# EAGLE design Front PCB (EAGLE 5.11)
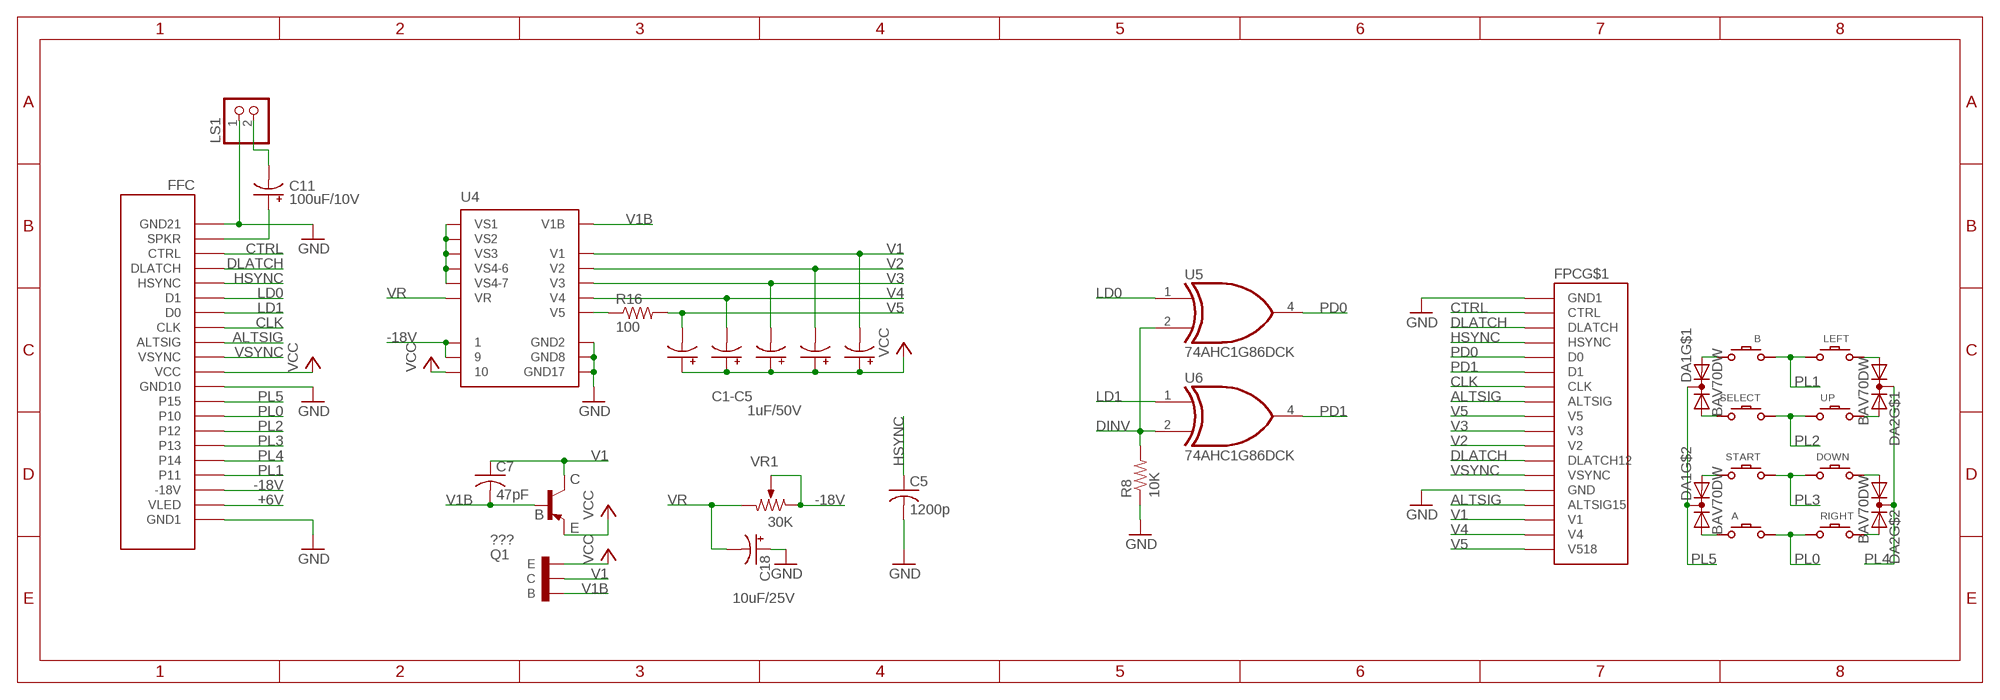
[diagram p0: schematic, sheet 1]

## Parts
A  DMG-BTN  DMG-BTNREGULAR  [DMG-BTN]
B  DMG-BTN  DMG-BTNREGULAR  [DMG-BTN]
C5  1200p  C0603  [R0603]
C7  47pF  C0603  [R0603]
C11  100uF/10V  C1206  [C1206]
C13  1uF/50V  C1206  [C1206]
C14  1uF/50V  C1206  [C1206]
C15  1uF/50V  C1206  [C1206]
C16  1uF/50V  C1206  [C1206]
C17  1uF/50V  C1206  [C1206]
C18  10uF/25V  C1206  [C1206]
DA1  BAV70DW  [SOT363]
DA2  BAV70DW  [SOT363]
DOWN  DMG-BTN  DMG-BTNREGULAR  [DMG-BTN]
FFC  DMG-SCREENFFC  [DMG-FFC]
FPC  MGB-SCREEN  [MGB-SCREEN]
LEFT  DMG-BTN  DMG-BTNREGULAR  [DMG-BTN]
LS1  PINHD-1X2LONG  [1X02]
Q1  ???  BF821SMD  [SOT23-BEC]
Q2  ECB  [ECB]
R8  10K  R0603  [R0603]
R16  100  R0603  [R0603]
RIGHT  DMG-BTN  DMG-BTNREGULAR  [DMG-BTN]
SELECT  DMG-BTN  DMG-BTNSELECT  [DMG-SEL]
START  DMG-BTN  DMG-BTNSTART  [DMG-ST]
U4  DMG-REG  [DMG-AMP]
U5  74AHC1G86DCK  [SC70-5]
U6  74AHC1G86DCK  [SC70-5]
UP  DMG-BTN  DMG-BTNREGULAR  [DMG-BTN]
VR1  30K  DMG-CONTRAST  [DMG-POT]

## Nets
+6V: FFC.P$2(VLED)
-18V: FFC.P$3(-18V) U4.P$1 U4.P$9 VR1.P$1 VR1.P$2
ALTSIG: FFC.P$13(ALTSIG) FPC.P$8(ALTSIG) FPC.P$15(ALTSIG15)
CLK: FFC.P$14(CLK) FPC.P$7(CLK)
CTRL: FFC.P$19(CTRL) FPC.P$2(CTRL)
DINV: R8.2 U5.2(I1) U6.2(I1)
DLATCH: FFC.P$18(DLATCH) FPC.P$3(DLATCH) FPC.P$12(DLATCH12)
GND: C5.2 C18.+ FFC.P$1(GND1) FFC.P$10(GND10) FFC.P$21(GND21) FPC.P$1(GND1) FPC.P$14(GND) LS1.1 R8.1 U4.P$2(GND2) U4.P$8(GND8) U4.P$17(GND17)
HSYNC: C5.1 FFC.P$17(HSYNC) FPC.P$4(HSYNC)
LD0: FFC.P$16(D1) U5.1(I0)
LD1: FFC.P$15(D0) U6.1(I0)
N$1: DA2.P$5(A2) RIGHT.P$2
N$2: DA2.P$4(A1) DOWN.P$1
N$3: B.P$2 DA1.P$2(A2)
N$4: DA2.P$1(A1) LEFT.P$1
N$5: A.P$1 DA1.P$4(A1)
N$6: DA1.P$1(A1) SELECT.P$2
N$7: DA1.P$5(A2) START.P$2
N$8: DA2.P$2(A2) UP.P$2
N$10: R16.1 U4.P$14(V5)
N$11: U4.P$3(VS1) U4.P$4(VS2) U4.P$5(VS3) U4.P$6(VS4-6) U4.P$7(VS4-7)
N$14: C11.- LS1.2
PD0: FPC.P$5(D0) U5.4(O)
PD1: FPC.P$6(D1) U6.4(O)
PL0: A.P$2 FFC.P$8(P10) RIGHT.P$1
PL1: B.P$1 FFC.P$4(P11) LEFT.P$2
PL2: FFC.P$7(P12) SELECT.P$1 UP.P$1
PL3: DOWN.P$2 FFC.P$6(P13) START.P$1
PL4: DA2.P$3(K) DA2.P$6(K) FFC.P$5(P14)
PL5: DA1.P$3(K) DA1.P$6(K) FFC.P$9(P15)
SPKR: C11.+ FFC.P$20(SPKR)
V1: C7.1 C16.- FPC.P$16(V1) Q1.C Q2.P$2(C) U4.P$12(V1)
V1B: C7.2 Q1.B Q2.P$3(B) U4.P$11(V1B)
V2: C14.- FPC.P$11(V2) U4.P$15(V2)
V3: C13.- FPC.P$10(V3) U4.P$16(V3)
V4: C15.- FPC.P$17(V4) U4.P$13(V4)
V5: C17.- FPC.P$9(V5) FPC.P$18(V518) R16.2
VCC: C13.+ C14.+ C15.+ C16.+ C17.+ FFC.P$11(VCC) Q1.E Q2.P$1(E) U4.P$10
VR: C18.- U4.P$18(VR) VR1.P$5
VSYNC: FFC.P$12(VSYNC) FPC.P$13(VSYNC)

## Notes on the sheet
- C1-C5
- C
- B
- E

## Power pins joined to a net without a drawn wire
GND: FPC.P$19(GND) FPC.P$20(GND) U5.3(GND) U6.3(GND) VR1.P$6(GND) VR1.P$7(GND)
VCC: U5.5(VCC) U6.5(VCC)

## Library data of the parts
A B DOWN LEFT RIGHT SELECT START UP = Game Boy:DMG-BTN
C5 C7 = Misc:C0603
C11 C13-C18 = Misc:C1206
DA1 DA2 = Misc:BAV70DW
FFC = Game Boy:DMG-SCREEN: The white connector for the ribbon cable to connect the DMG's front half
FPC = Game Boy:MGB-SCREEN
LS1 = header:PINHD-1X2: PIN HEADER
Q1 = transistor-pnp:BF821*: PNP Transistror
Q2 = Game Boy:ECB
R8 R16 = Misc:R0603
U4 = Game Boy:DMG-REG
U5 U6 = 74xx-little-us:74*1G86: 2-input EXCLUSIV-OR gate
VR1 = Game Boy:DMG-CONTRAST

## Board
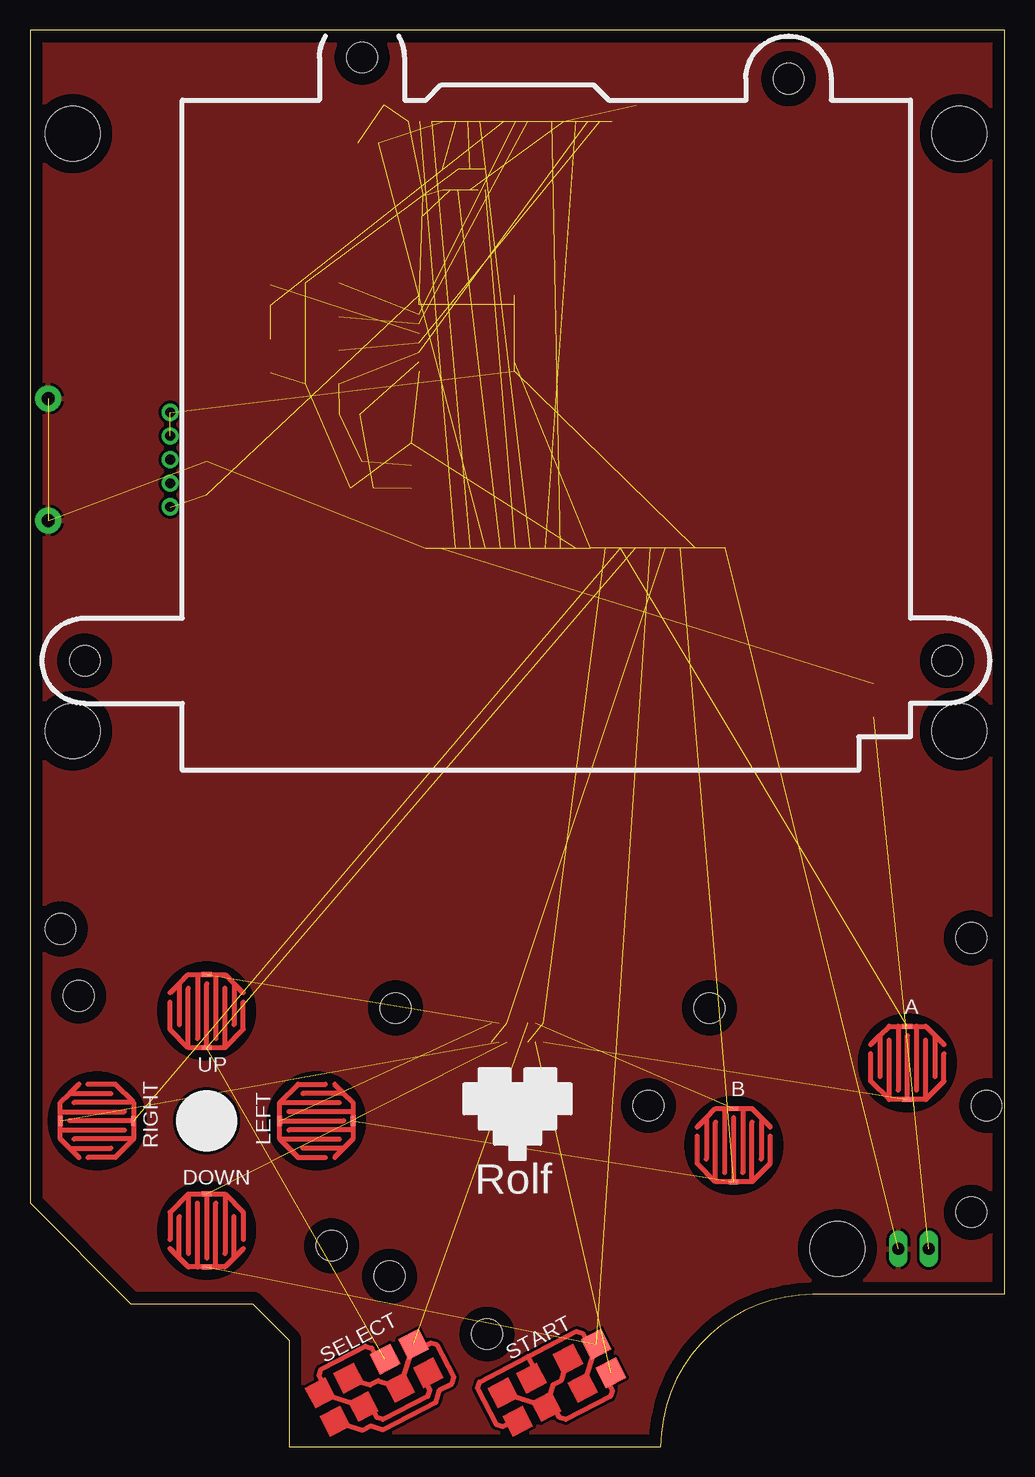
[diagram p1: board, top side]
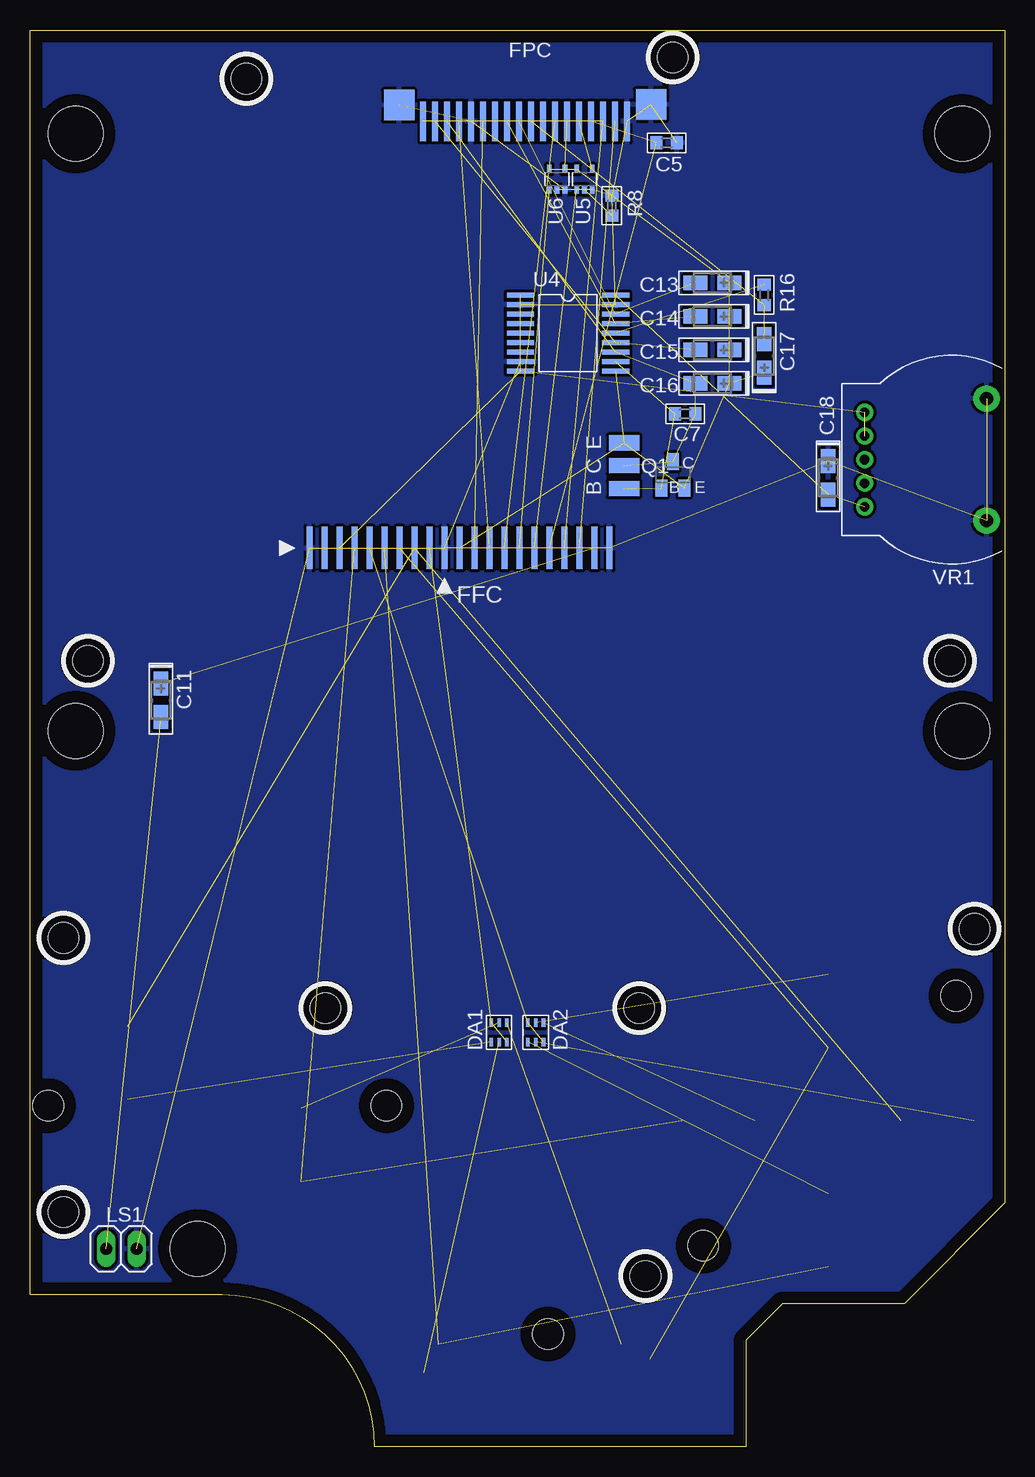
[diagram p2: board, bottom side, seen from below]

Size 81.28 x 118.11 mm. Coordinates in mm from the lower left corner, seen from the top.
Outline: 0,20.32 8.38,11.94 18.54,11.94 21.59,8.89 21.59,0 52.58,0 arc-90 65.28,12.7 81.28,12.7 81.28,118.11 0,118.11 0,20.32
Copper layers (1*16): Top 0.035mm / dielectric 1.5mm / Bottom 0.035mm
Design rules "default *": minimum track width 10mil, minimum drill 20mil, track to track 10mil, track to pad 10mil, pad to pad 10mil, via to via 10mil, smd to smd 10mil, copper to edge 40mil, drill to drill 20mil, minimum pad ring 10mil, minimum via ring 8mil, stop-mask expansion 4mil, vias tented up to drill 20mil, thermal gap 10mil
Holes 4.57 mm at 3.56,59.69 77.47,59.69 3.56,109.47 77.47,109.47 67.31,16.51
Holes 2.54 mm at 27.69,115.82 63.25,114.05 76.45,65.53 2.54,43.18 78.49,42.42 78.49,19.56 30.48,36.58 56.64,36.58 29.97,14.22 51.56,28.45 25.15,16.76 38.1,9.4 79.76,28.45 4.06,37.59 4.57,65.53

### Footprints (pad centres in the part's own frame; a part is rotated, then mirrored left to right if it is on the bottom)
DMG-BTN = smd 0.813 x 0.406: P$1 0,-3.048; P$2 0,3.048
R0603 = smd 1 x 1.1: 1 -0.85,0; 2 0.85,0
C1206 = smd 2 x 1.2: + -1.4,0; - 1.4,0
SOT363 = smd 0.3 x 0.7: P$1 -0.65,-0.8; P$2 0,-0.8; P$3 0.65,-0.8; P$4 0.65,0.8; P$5 0,0.8; P$6 -0.65,0.8
DMG-FFC = smd 0.508 x 3.556: P$1 -12.5,0; P$2 -11.25,0; P$3 -10,0; P$4 -8.75,0; P$5 -7.5,0; P$6 -6.25,0; P$7 -5,0; P$8 -3.75,0; P$9 -2.5,0; P$10 -1.25,0; P$11 0,0; P$12 1.25,0; P$13 2.5,0; P$14 3.75,0; P$15 5,0; P$16 6.25,0; P$17 7.5,0; P$18 8.75,0; P$19 10,0; P$20 11.25,0; P$21 12.5,0
MGB-SCREEN = smd 0.508 x 3.302: P$1 8.5,0; P$2 7.5,0; P$3 6.5,0; P$4 5.5,0; P$5 4.5,0; P$6 3.5,0; P$7 2.5,0; P$8 1.5,0; P$9 0.5,0; P$10 -0.5,0; P$11 -1.5,0; P$12 -2.5,0; P$13 -3.5,0; P$14 -4.5,0; P$15 -5.5,0; P$16 -6.5,0; P$17 -7.5,0; P$18 -8.5,0 | smd 2.54 x 2.54: P$19 -10.5,1.367; P$20 10.5,1.397
1X02 = drill 1.016 long: 1 -1.27,0; 2 1.27,0
SOT23-BEC = smd 1 x 1.4: B -0.95,-1.1; C 0,1.1; E 0.95,-1.1
ECB = smd 1.27 x 2.54: P$1 -1.905,0; P$2 0,0; P$3 1.905,0
DMG-SEL = smd 1.905 x 1.905: P$1 1.714,1.333; P$2 4.381,1.333
DMG-ST = smd 1.905 x 1.905: P$1 4.381,1.333; P$2 4.381,-1.333
DMG-AMP = smd 0.406 x 2.286: P$1 -3.175,-3.969; P$2 -2.381,-3.969; P$3 -1.587,-3.969; P$4 -0.794,-3.969; P$5 0,-3.969; P$6 0.794,-3.969; P$7 1.587,-3.969; P$8 2.381,-3.969; P$9 3.175,-3.969; P$10 3.175,3.969; P$11 2.381,3.969; P$12 1.587,3.969; P$13 0.794,3.969; P$14 0,3.969; P$15 -0.794,3.969; P$16 -1.587,3.969; P$17 -2.381,3.969; P$18 -3.175,3.969
SC70-5 = smd 0.4 x 0.7: 1 -0.65,-0.85; 2 0,-0.85; 3 0.65,-0.85; 4 0.65,0.85; 5 -0.65,0.85
DMG-POT = drill 0.8 pad 1.422 round: P$1 -3.937,-5.08; P$2 -1.968,-5.08; P$3 0,-5.08; P$4 1.968,-5.08; P$5 3.937,-5.08 | drill 1.1 pad 2.184 round: P$6 -5.08,5.08; P$7 5.08,5.08

### Placement (x,y rotation side)
A  73.15,32 0 top
B  58.67,25.15 0 top
C5  28.19,108.71 0 bottom
C7  26.67,86.11 180 bottom
C11  70.36,62.23 270 bottom
C13  24.38,97.03 180 bottom
C14  24.38,94.23 180 bottom
C15  24.38,91.44 180 bottom
C16  24.38,88.65 180 bottom
C17  20.07,90.93 90 bottom
C18  14.73,80.77 270 bottom
DA1  42.16,34.54 180 bottom
DA2  39.12,34.54 180 bottom
DOWN  14.73,18.03 180 top
FFC  45.47,74.93 0 bottom
FPC  40.01,110.49 0 bottom
LEFT  23.88,27.18 270 top
LS1  73.66,16.51 180 bottom
Q1  27.69,81.03 0 bottom
Q2  31.75,81.79 270 bottom
R8  32.77,103.47 270 bottom
R16  20.07,96.01 270 bottom
RIGHT  5.59,27.18 90 top
SELECT  28.7,5.33 27.5 top
START  43.94,5.33 27.5 top
U4  36.42,92.84 270 bottom
U5  35.05,105.66 0 bottom
U6  37.34,105.66 0 bottom
UP  14.73,36.32 0 top
VR1  6.6,82.3 270 bottom

### Tracks (layer width: path | path; a pad name or v marks a point on that pad's centre or on a via)
-18V  (4 unrouted)
ALTSIG  (2 unrouted)
CLK  (1 unrouted)
CTRL  (1 unrouted)
DINV  (2 unrouted)
DLATCH  (2 unrouted)
GND  (17 unrouted)
  pour Top: 0,118.11 81.28,118.11 81.28,12.7 65.28,12.7 arc90 52.58,0 21.59,0 21.59,8.89 18.54,11.94 8.38,11.94 0,20.32
  pour Bottom: 0,118.11 81.28,118.11 81.28,12.7 65.28,12.7 arc90 52.58,0 21.59,0 21.59,8.89 18.54,11.94 8.38,11.94 0,20.32
HSYNC  (2 unrouted)
LD0  (1 unrouted)
LD1  (1 unrouted)
N$1  (1 unrouted)
N$2  (1 unrouted)
N$3  (1 unrouted)
N$4  (1 unrouted)
N$5  (1 unrouted)
N$6  (1 unrouted)
N$7  (1 unrouted)
N$8  (1 unrouted)
N$10  (1 unrouted)
N$11  (4 unrouted)
N$14  (1 unrouted)
PD0  (1 unrouted)
PD1  (1 unrouted)
PL0  (2 unrouted)
PL1  (2 unrouted)
PL2  (2 unrouted)
PL3  (2 unrouted)
PL4  (2 unrouted)
PL5  (2 unrouted)
SPKR  (1 unrouted)
V1  (5 unrouted)
V1B  (3 unrouted)
V2  (2 unrouted)
V3  (2 unrouted)
V4  (2 unrouted)
V5  (3 unrouted)
VCC  (10 unrouted)
VR  (2 unrouted)
VSYNC  (1 unrouted)
(copper drawn outside any net)
  shapes: Top circle x1

### Text on the board
tPlace: Rolf
bPlace: C | E | B